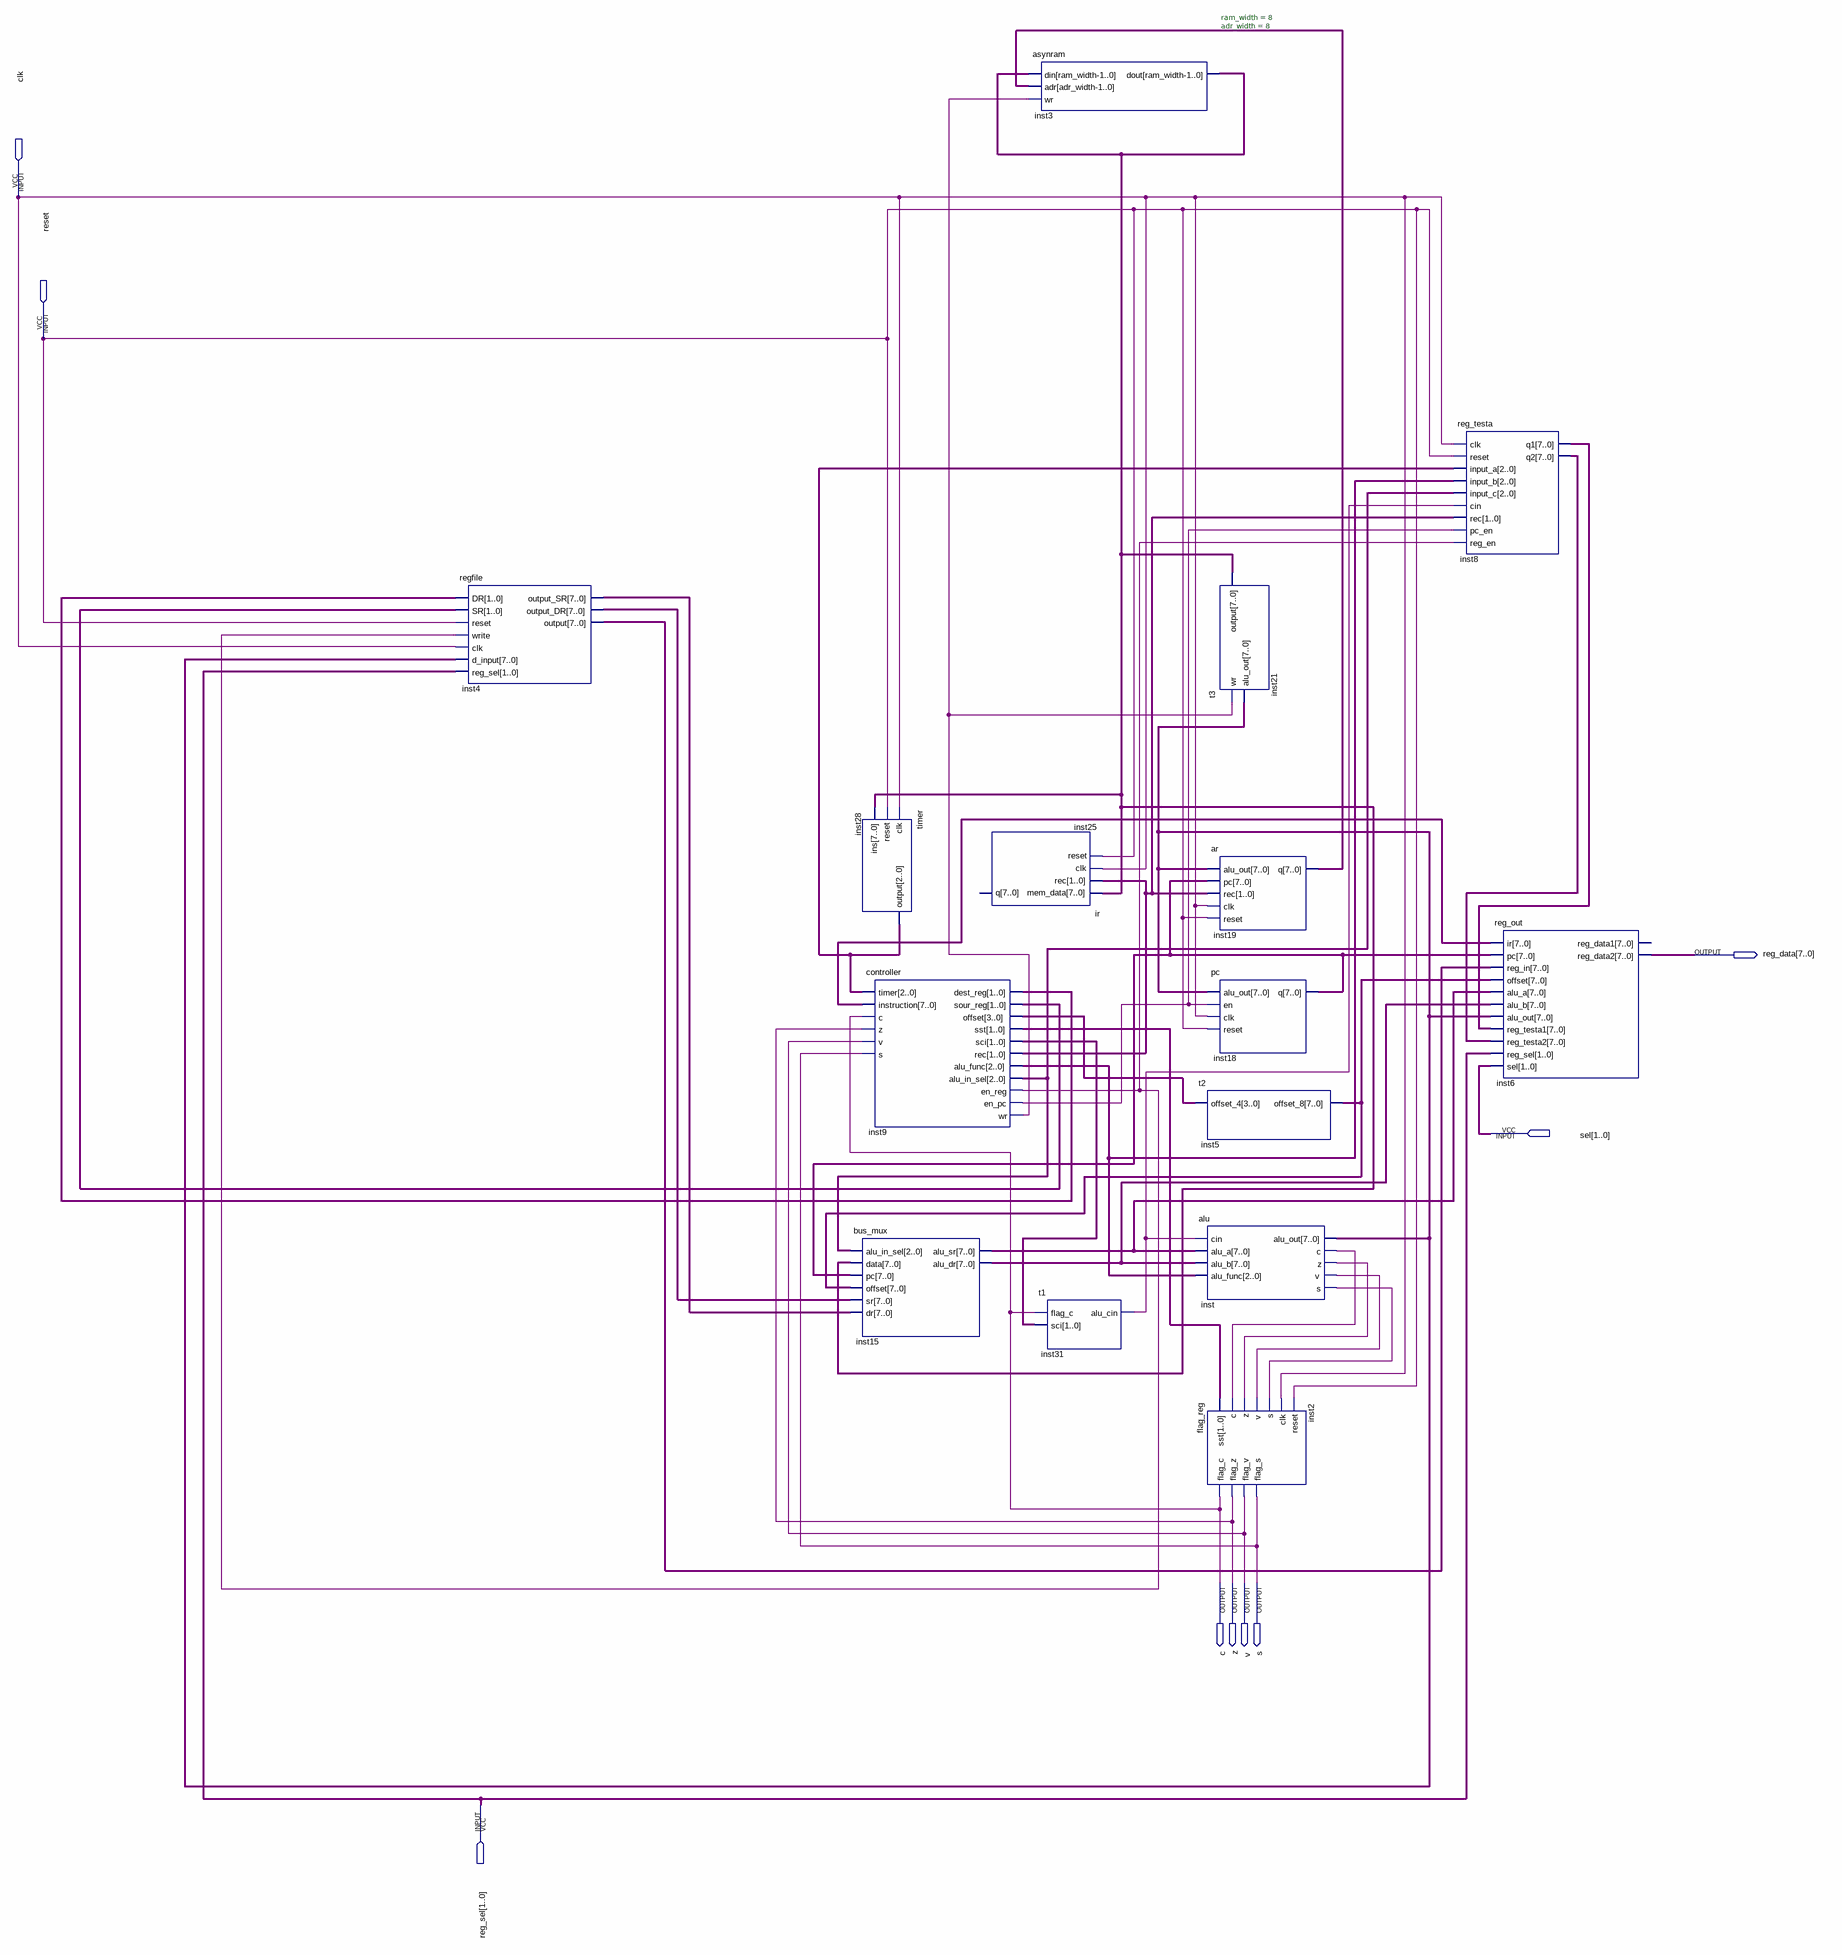
[diagram p0: schematic sheet]
// Quartus schematic cpu0.bdf as structural Verilog: 15 symbols, 9 pins
module cpu0 (
  input  clk,
  input  reset,
  input  [1:0] sel,
  input  [1:0] reg_sel,
  output [7:0] reg_data,
  output c,
  output z,
  output v,
  output s
);

  wire inst9_en_pc, inst9_en_reg, inst9_wr, inst31_alu_cin, inst_c, inst_s, inst_v, inst_z;
  wire [1:0] inst9_dest_reg, inst9_rec, inst9_sci, inst9_sour_reg, inst9_sst;
  wire [2:0] inst9_alu_func, inst9_alu_in_sel, inst28_output;
  wire [3:0] inst9_offset;
  wire [7:0] inst3_dout, inst4_output, inst4_output_dr, inst4_output_sr, inst5_offset_8, inst8_q1, inst8_q2,
       inst15_alu_dr, inst15_alu_sr, inst18_q, inst19_q, inst_alu_out, undriven;

  regfile inst4 (
    .DR(inst9_dest_reg), .SR(inst9_sour_reg), .reset(reset), .write(inst9_en_reg), .clk(clk),
    .d_input(inst_alu_out), .reg_sel(reg_sel), .output_SR(inst4_output_sr), .output_DR(inst4_output_dr),
    .\output (inst4_output));
  timer inst28 (.clk(clk), .reset(reset), .ins(inst3_dout), .\output (inst28_output));
  controller inst9 (
    .timer(inst28_output), .instruction(undriven), .c(c), .z(z), .v(v), .s(s), .dest_reg(inst9_dest_reg),
    .sour_reg(inst9_sour_reg), .offset(inst9_offset), .sst(inst9_sst), .sci(inst9_sci), .rec(inst9_rec),
    .alu_func(inst9_alu_func), .alu_in_sel(inst9_alu_in_sel), .en_reg(inst9_en_reg), .en_pc(inst9_en_pc),
    .wr(inst9_wr));
  bus_mux inst15 (
    .alu_in_sel(inst9_alu_in_sel), .data(inst3_dout), .pc(inst18_q), .offset(inst5_offset_8),
    .sr(inst4_output_dr), .dr(inst4_output_sr), .alu_sr(inst15_alu_sr), .alu_dr(inst15_alu_dr));
  ir inst25 (.mem_data(inst3_dout), .rec(inst9_rec), .clk(clk), .reset(reset));  // open: q
  asynram #(.ram_width(8), .adr_width(8)) inst3 (.din(inst3_dout), .adr(inst19_q), .wr(inst9_wr), .dout(inst3_dout));
  t1 inst31 (.flag_c(c), .sci(inst9_sci), .alu_cin(inst31_alu_cin));
  t3 inst21 (.wr(inst9_wr), .alu_out(inst_alu_out), .\output (inst3_dout));
  ar inst19 (.alu_out(inst_alu_out), .pc(inst18_q), .rec(inst9_rec), .clk(clk), .reset(reset), .q(inst19_q));
  pc inst18 (.alu_out(inst_alu_out), .en(inst9_en_pc), .clk(clk), .reset(reset), .q(inst18_q));
  t2 inst5 (.offset_4(inst9_offset), .offset_8(inst5_offset_8));
  alu inst (
    .cin(inst31_alu_cin), .alu_a(inst15_alu_sr), .alu_b(inst15_alu_dr), .alu_func(inst9_alu_func),
    .alu_out(inst_alu_out), .c(inst_c), .z(inst_z), .v(inst_v), .s(inst_s));
  flag_reg inst2 (
    .sst(inst9_sst), .c(inst_c), .z(inst_z), .v(inst_v), .s(inst_s), .clk(clk), .reset(reset), .flag_c(c),
    .flag_z(z), .flag_v(v), .flag_s(s));
  reg_testa inst8 (
    .clk(clk), .reset(reset), .input_a(inst28_output), .input_b(inst9_alu_func), .input_c(inst9_alu_in_sel),
    .cin(inst31_alu_cin), .rec(inst9_rec), .pc_en(inst9_en_pc), .reg_en(inst9_en_reg), .q1(inst8_q1),
    .q2(inst8_q2));
  reg_out inst6 (
    .ir(undriven), .pc(inst18_q), .reg_in(inst4_output), .offset(inst5_offset_8), .alu_a(inst15_alu_sr),
    .alu_b(inst15_alu_dr), .alu_out(inst_alu_out), .reg_testa1(inst8_q1), .reg_testa2(inst8_q2),
    .reg_sel(reg_sel), .sel(sel), .reg_data2(reg_data));  // open: reg_data1
endmodule
